# EAGLE schematic Nebenplatine (EAGLE 7.1.0)
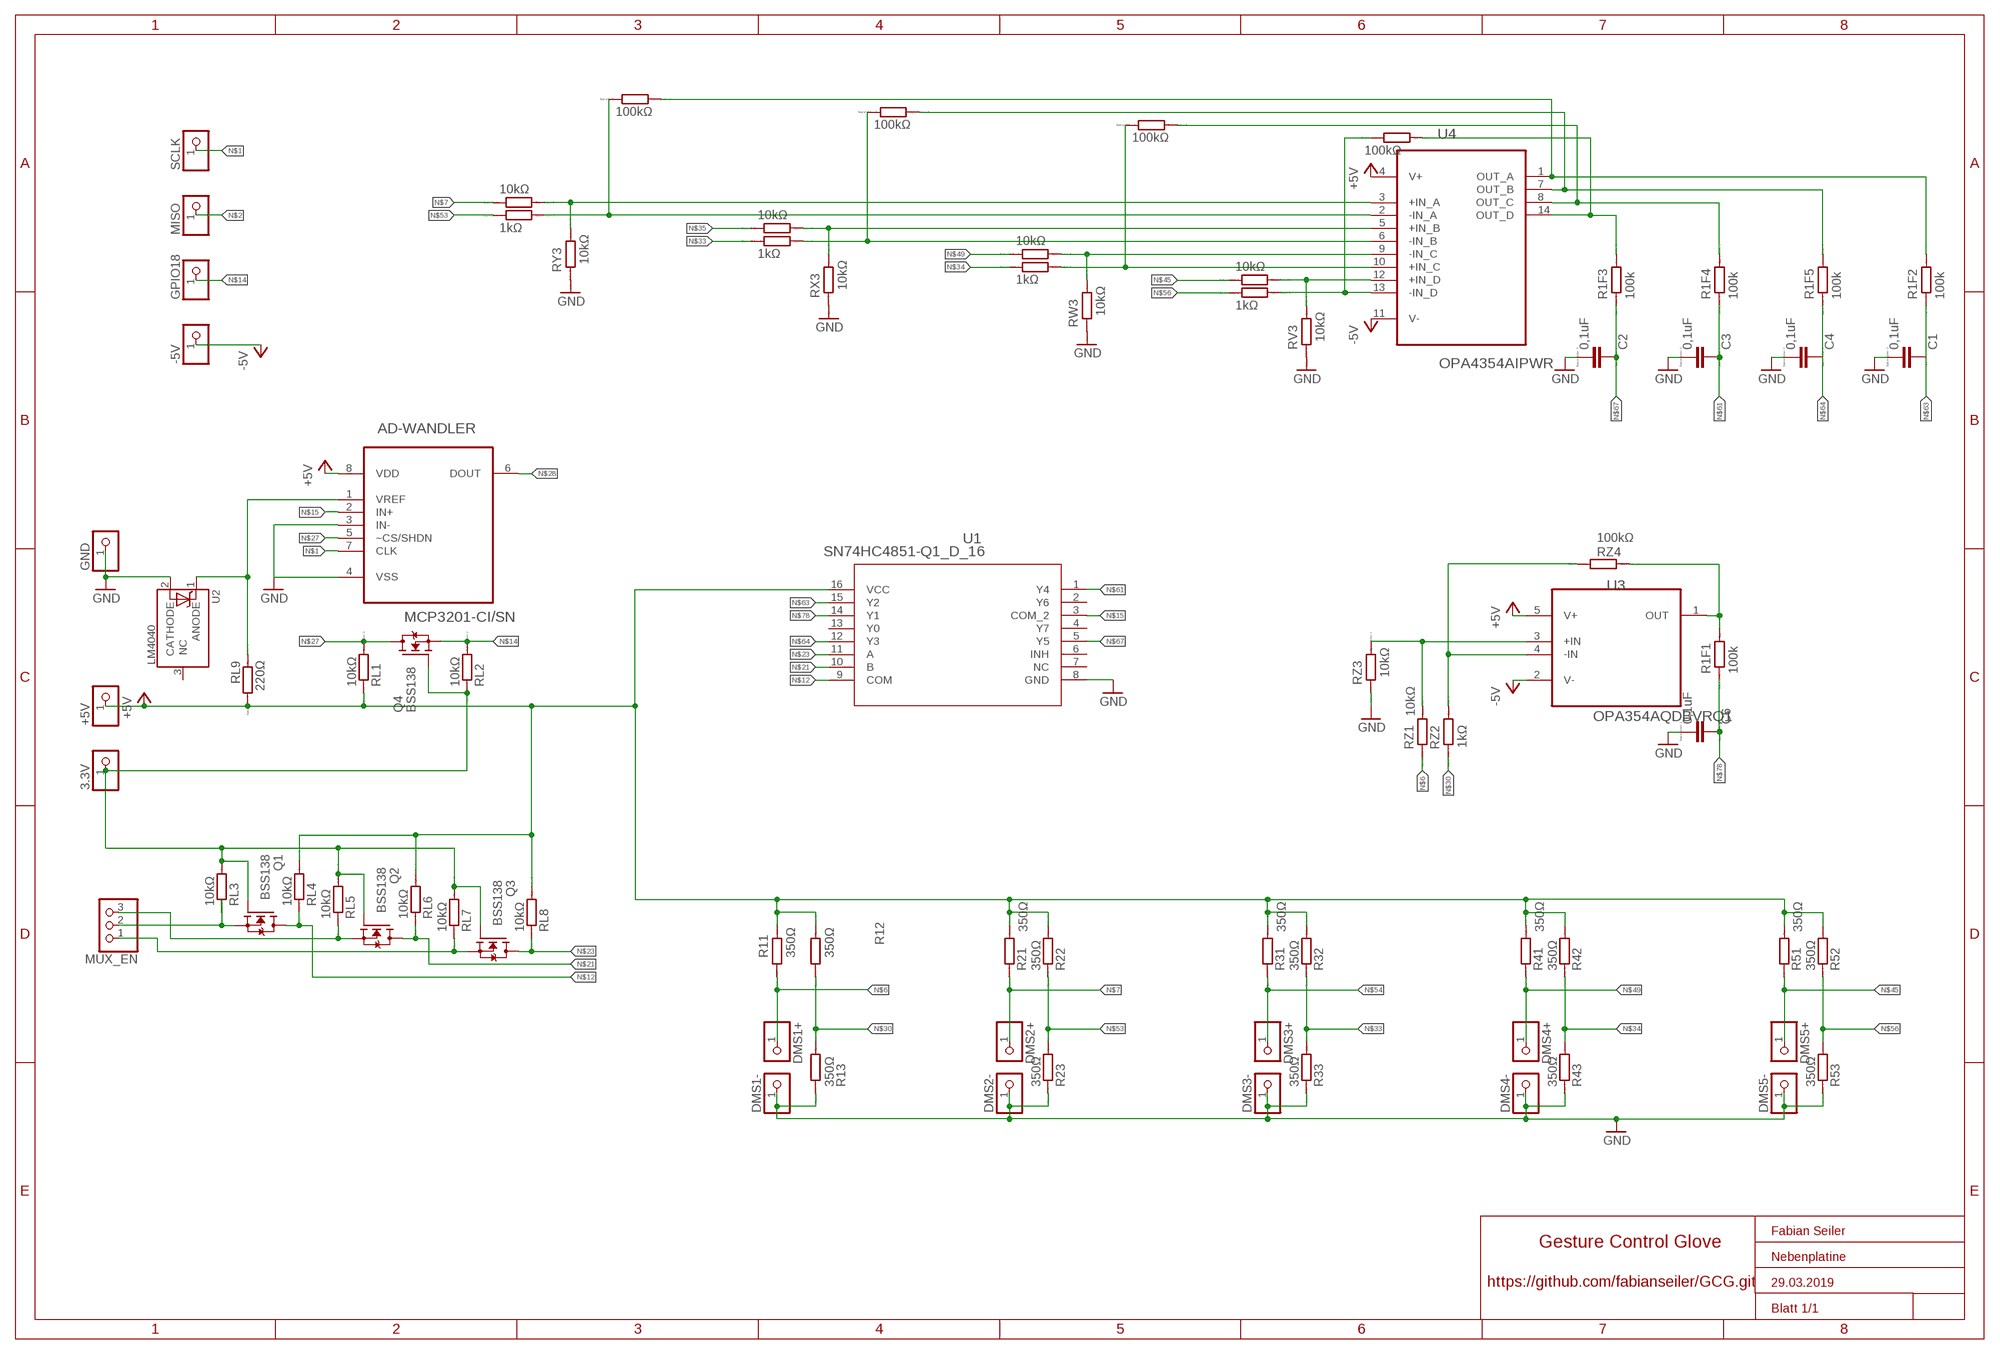
[diagram p0: schematic, sheet 1]

## Parts
3.3V  PINHD-1X1CB  [1X01-CLEANBIG]
+5V  PINHD-1X1CB  [1X01-CLEANBIG]
-5V  PINHD-1X1CB  [1X01-CLEANBIG]
AD-WANDLER  MCP3201-CI/SN  [SOIC127P600X175-8N]
C1  0,1uF  C-EUC0402  [C0402]
C2  0,1uF  C-EUC0402  [C0402]
C3  0,1uF  C-EUC0402  [C0402]
C4  0,1uF  C-EUC0402  [C0402]
C6  0,1uF  C-EUC0402  [C0402]
DMS1+  PINHD-1X1CB  [1X01-CLEANBIG]
DMS1-  PINHD-1X1CB  [1X01-CLEANBIG]
DMS2+  PINHD-1X1CB  [1X01-CLEANBIG]
DMS2-  PINHD-1X1CB  [1X01-CLEANBIG]
DMS3+  PINHD-1X1CB  [1X01-CLEANBIG]
DMS3-  PINHD-1X1CB  [1X01-CLEANBIG]
DMS4+  PINHD-1X1CB  [1X01-CLEANBIG]
DMS4-  PINHD-1X1CB  [1X01-CLEANBIG]
DMS5+  PINHD-1X1CB  [1X01-CLEANBIG]
DMS5-  PINHD-1X1CB  [1X01-CLEANBIG]
GND  PINHD-1X1CB  [1X01-CLEANBIG]
GPIO18  PINHD-1X1CB  [1X01-CLEANBIG]
MISO  PINHD-1X1CB  [1X01-CLEANBIG]
MUX_EN  PINHD-1X3CB  [1X03-CLEANBIG]
Q1  BSS138  [SOT23]
Q2  BSS138  [SOT23]
Q3  BSS138  [SOT23]
Q4  BSS138  [SOT23]
R1F1  100k  R-EU_R0402  [R0402]
R1F2  100k  R-EU_R0402  [R0402]
R1F3  100k  R-EU_R0402  [R0402]
R1F4  100k  R-EU_R0402  [R0402]
R1F5  100k  R-EU_R0402  [R0402]
R11  350Ω  R-EU_R0402  [R0402]
R12  350Ω  R-EU_R0402  [R0402]
R13  350Ω  R-EU_R0402  [R0402]
R21  350Ω  R-EU_R0402  [R0402]
R22  350Ω  R-EU_R0402  [R0402]
R23  350Ω  R-EU_R0402  [R0402]
R31  350Ω  R-EU_R0402  [R0402]
R32  350Ω  R-EU_R0402  [R0402]
R33  350Ω  R-EU_R0402  [R0402]
R41  350Ω  R-EU_R0402  [R0402]
R42  350Ω  R-EU_R0402  [R0402]
R43  350Ω  R-EU_R0402  [R0402]
R51  350Ω  R-EU_R0402  [R0402]
R52  350Ω  R-EU_R0402  [R0402]
R53  350Ω  R-EU_R0402  [R0402]
RL1  10kΩ  R-EU_R0402  [R0402]
RL2  10kΩ  R-EU_R0402  [R0402]
RL3  10kΩ  R-EU_R0402  [R0402]
RL4  10kΩ  R-EU_R0402  [R0402]
RL5  10kΩ  R-EU_R0402  [R0402]
RL6  10kΩ  R-EU_R0402  [R0402]
RL7  10kΩ  R-EU_R0402  [R0402]
RL8  10kΩ  R-EU_R0402  [R0402]
RL9  220Ω  R-EU_R0402  [R0402]
RV1  1kΩ  R-EU_R0402  [R0402]
RV2  10kΩ  R-EU_R0402  [R0402]
RV3  10kΩ  R-EU_R0402  [R0402]
RV4  100kΩ  R-EU_R0402  [R0402]
RW1  1kΩ  R-EU_R0402  [R0402]
RW2  10kΩ  R-EU_R0402  [R0402]
RW3  10kΩ  R-EU_R0402  [R0402]
RW4  100kΩ  R-EU_R0402  [R0402]
RX1  1kΩ  R-EU_R0402  [R0402]
RX2  10kΩ  R-EU_R0402  [R0402]
RX3  10kΩ  R-EU_R0402  [R0402]
RX4  100kΩ  R-EU_R0402  [R0402]
RY1  10kΩ  R-EU_R0402  [R0402]
RY2  1kΩ  R-EU_R0402  [R0402]
RY3  10kΩ  R-EU_R0402  [R0402]
RY4  100kΩ  R-EU_R0402  [R0402]
RZ1  10kΩ  R-EU_R0402  [R0402]
RZ2  1kΩ  R-EU_R0402  [R0402]
RZ3  10kΩ  R-EU_R0402  [R0402]
RZ4  100kΩ  R-EU_R0402  [R0402]
SCLK  PINHD-1X1CB  [1X01-CLEANBIG]
U1  SN74HC4851-Q1_D_16  [D16]
U2  LM4040  [SOT23-3]
U3  OPA354AQDBVRQ1  [SOT95P280X145-5N]
U4  OPA4354AIPWR  [SOP65P640X120-14N]

## Nets
+5V: +5V.1 AD-WANDLER.8(VDD) R11.2 R12.2 R21.2 R22.2 R31.2 R32.2 R41.2 R42.2 R51.2 R52.2 RL1.1 RL4.2 RL6.2 RL8.2 RL9.2 U1.16(VCC) U3.5(V+) U4.4(V+)
-5V: -5V.1 U3.2(V-) U4.11(V-)
GND: AD-WANDLER.3(IN-) AD-WANDLER.4(VSS) C1.2 C2.2 C3.2 C4.2 C6.2 DMS1-.1 DMS2-.1 DMS3-.1 DMS4-.1 DMS5-.1 GND.1 R13.1 R23.1 R33.1 R43.1 R53.1 RV3.2 RW3.2 RX3.2 RY3.2 RZ3.2 U1.8(GND) U2.2(CATHODE)
N$1: AD-WANDLER.7(CLK) SCLK.1
N$2: MISO.1
N$4: 3.3V.1 Q1.1(G) Q2.1(G) Q3.1(G) Q4.1(G) RL2.1 RL3.2 RL5.2 RL7.2
N$5: AD-WANDLER.1(VREF) RL9.1 U2.1(ANODE)
N$6: DMS1+.1 R11.1 RZ1.2
N$7: DMS2+.1 R21.1 RY1.1
N$8: RY1.2 RY3.1 U4.3(+IN_A)
N$11: MUX_EN.3 Q2.2(S) RL5.1
N$12: Q1.3(D) RL4.1 U1.9(COM)
N$14: GPIO18.1 Q4.2(S) RL2.2
N$15: AD-WANDLER.2(IN+) U1.3(COM_2)
N$20: MUX_EN.1 Q3.2(S) RL7.1
N$21: Q2.3(D) RL6.1 U1.10(B)
N$22: MUX_EN.2 Q1.2(S) RL3.1
N$23: Q3.3(D) RL8.1 U1.11(A)
N$27: AD-WANDLER.5(~CS/SHDN) Q4.3(D) RL1.2
N$28: AD-WANDLER.6(DOUT)
N$30: R12.1 R13.2 RZ2.2
N$31: RX2.2 RX3.1 U4.5(+IN_B)
N$33: R32.1 R33.2 RX1.1
N$34: R42.1 R43.2 RW1.1
N$35: RX2.1
N$43: RZ1.1 RZ3.1 U3.3(+IN)
N$44: RZ2.1 RZ4.1 U3.4(-IN)
N$45: DMS5+.1 R51.1 RV2.1
N$49: DMS4+.1 R41.1 RW2.1
N$53: R22.1 R23.2 RY2.1
N$54: DMS3+.1 R31.1 RY2.2 RY4.1 U4.2(-IN_A)
N$55: RX1.2 RX4.1 U4.6(-IN_B)
N$56: R52.1 R53.2 RV1.1
N$57: RW2.2 RW3.1 U4.9(-IN_C)
N$58: RV2.2 RV3.1 U4.12(+IN_D)
N$59: RW1.2 RW4.1 U4.10(+IN_C)
N$60: RV1.2 RV4.1 U4.13(-IN_D)
N$61: C3.1 R1F4.1 U1.1(Y4)
N$63: C1.1 R1F2.1 U1.15(Y2)
N$64: C4.1 R1F5.1 U1.12(Y3)
N$67: C2.1 R1F3.1 U1.5(Y5)
N$77: R1F1.2 RZ4.2 U3.1(OUT)
N$78: C6.1 R1F1.1 U1.14(Y1)
N$81: R1F2.2 RY4.2 U4.1(OUT_A)
N$82: R1F5.2 RX4.2 U4.7(OUT_B)
N$83: R1F4.2 RW4.2 U4.8(OUT_C)
N$84: R1F3.2 RV4.2 U4.14(OUT_D)
Unconnected: U1.2(Y6) U1.4(Y7) U1.6(INH) U1.7(NC) U1.13(Y0) U2.3(NC)

## Notes on the sheet
- Fabian Seiler
- Gesture Control Glove
- Nebenplatine
- https://github.com/fabianseiler/GCG.git | 29.03.2019
- Blatt 1/1

## Library data of the parts
3.3V +5V -5V DMS1+ DMS1- DMS2+ DMS2- DMS3+ DMS3- DMS4+ DMS4- DMS5+ DMS5- GND GPIO18 MISO SCLK = adafruit:PINHD-1X1: Pin header 1x1 for 0.1" spacing With round pins
AD-WANDLER = MCP3201-CI_SN:MCP3201-CI/SN: 12Bit A/D Converter; AVAILABILITY: Unavailable; DESCRIPTION: Single Channel SPI Serial Interface 2.7 V 12-Bit A/D Converter SMT - SOIC-8; MF: Microchip; MP: MCP3201-CI/SN; PACKAGE: SOIC-8 Microchip; PRICE: None
C1-C4 C6 = resistor:C-EU: CAPACITOR, European symbol; SPICEPREFIX: C
MUX_EN = adafruit:PINHD-1X3: PIN HEADER
Q1-Q4 = bss138_10:BSS138: BSS138 N-Channel Logic Level Enhancement Mode Field Effect Transistor Source: http://www.fairchildsemi.com/datasheets/BS/BSS138.pdf; MF: Fairchild; MPN: BSS138; OC_FARNELL: 9845330; OC_NEWARK: 67R2009
R1F1-R1F5 R11-R13 R21-R23 R31-R33 R41-R43 R51-R53 RL1-RL9 RV1-RV4 RW1-RW4 RX1-RX4 RY1-RY4 RZ1-RZ4 = resistor:R-EU_: RESISTOR, European symbol; SPICEPREFIX: R
U1 = Analog_MUX:SN74HC4851-Q1_D_16; MANUFACTURER_PART_NUMBER: SN74HC4851Q1_D_16; VENDOR: Texas Instruments
U2 = LM4040:LM4040; AVAILABILITY: Unavailable; DESCRIPTION: lm4040 improved precision micropower shunt voltage reference with multiple reverse breakdown voltages; MF: Amphenol; MP: LM4040; PACKAGE: None; PRICE: None
U3 = OPA354AQDBVRQ1:OPA354AQDBVRQ1: 250 MHz, RAIL-TO-RAIL I/O, CMOS OPERATIONAL AMPLIFIERS; AVAILABILITY: Unavailable; DESCRIPTION: Automotive 250MHz, Rail-to-Rail I/O, CMOS Single Operational Amplifier 5-SOT-23 -40 to 125; MF: Texas Instruments; MP: OPA354AQDBVRQ1; PACKAGE: SOT-23 Texas Instruments; PRICE: None
U4 = OPA4354AIPWR:OPA4354AIPWR: OPERATIONAL AMPLIFIERS; AVAILABILITY: Unavailable; DESCRIPTION: 250MHz, Rail-to-Rail I/O, CMOS Quad Operational Amplifier 14-TSSOP -40 to 125; MF: Texas Instruments; MP: OPA4354AIPWR; PACKAGE: TSSOP-14 Texas Instruments; PRICE: None